# EAGLE design tangnano9k-bob-adapter (EAGLE 9.0.1)
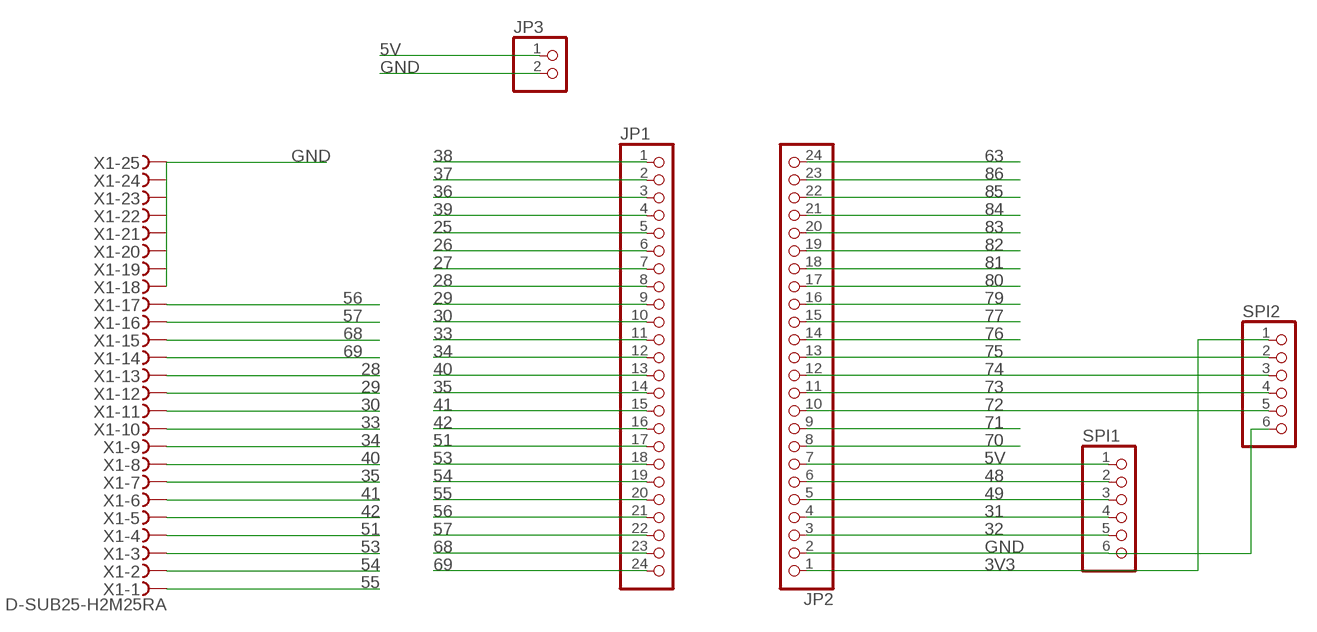
[diagram p0: schematic, sheet 1]

## Parts
JP1  PINHD-1X24  [1X24]
JP2  PINHD-1X24  [1X24]
JP3  PINHD-1X2  [1X02]
SPI1  PINHD-1X6  [1X06]
SPI2  PINHD-1X6  [1X06]
X1  D-SUB25-H2M25RA  [H2M25RA]

## Nets
3V3: JP2.1 SPI2.1
5V: JP2.7 JP3.1 SPI1.1
25: JP1.5
26: JP1.6
27: JP1.7
28: JP1.8 X1.13
29: JP1.9 X1.12
30: JP1.10 X1.11
31: JP2.4 SPI1.4
32: JP2.3 SPI1.5
33: JP1.11 X1.10
34: JP1.12 X1.9
35: JP1.14 X1.7
36: JP1.3
37: JP1.2
38: JP1.1
39: JP1.4
40: JP1.13 X1.8
41: JP1.15 X1.6
42: JP1.16 X1.5
48: JP2.6 SPI1.2
49: JP2.5 SPI1.3
51: JP1.17 X1.4
53: JP1.18 X1.3
54: JP1.19 X1.2
55: JP1.20 X1.1
56: JP1.21 X1.17
57: JP1.22 X1.16
63: JP2.24
68: JP1.23 X1.15
69: JP1.24 X1.14
70: JP2.8
71: JP2.9
72: JP2.10 SPI2.5
73: JP2.11 SPI2.4
74: JP2.12 SPI2.3
75: JP2.13 SPI2.2
76: JP2.14
77: JP2.15
79: JP2.16
80: JP2.17
81: JP2.18
82: JP2.19
83: JP2.20
84: JP2.21
85: JP2.22
86: JP2.23
GND: JP2.2 JP3.2 SPI1.6 SPI2.6 X1.18 X1.19 X1.20 X1.21 X1.22 X1.23 X1.24 X1.25

## Library data of the parts
JP1 JP2 = pinhead:PINHD-1X24: PIN HEADER
JP3 = pinhead:PINHD-1X2: PIN HEADER
SPI1 SPI2 = pinhead:PINHD-1X6: PIN HEADER
X1 = con-thomas-betts:D-SUB25-: D-Subminiatur Connector Source: Electronioc Interconnects European Edition 1998; OC_FARNELL: unknown; OC_NEWARK: unknown

## Board
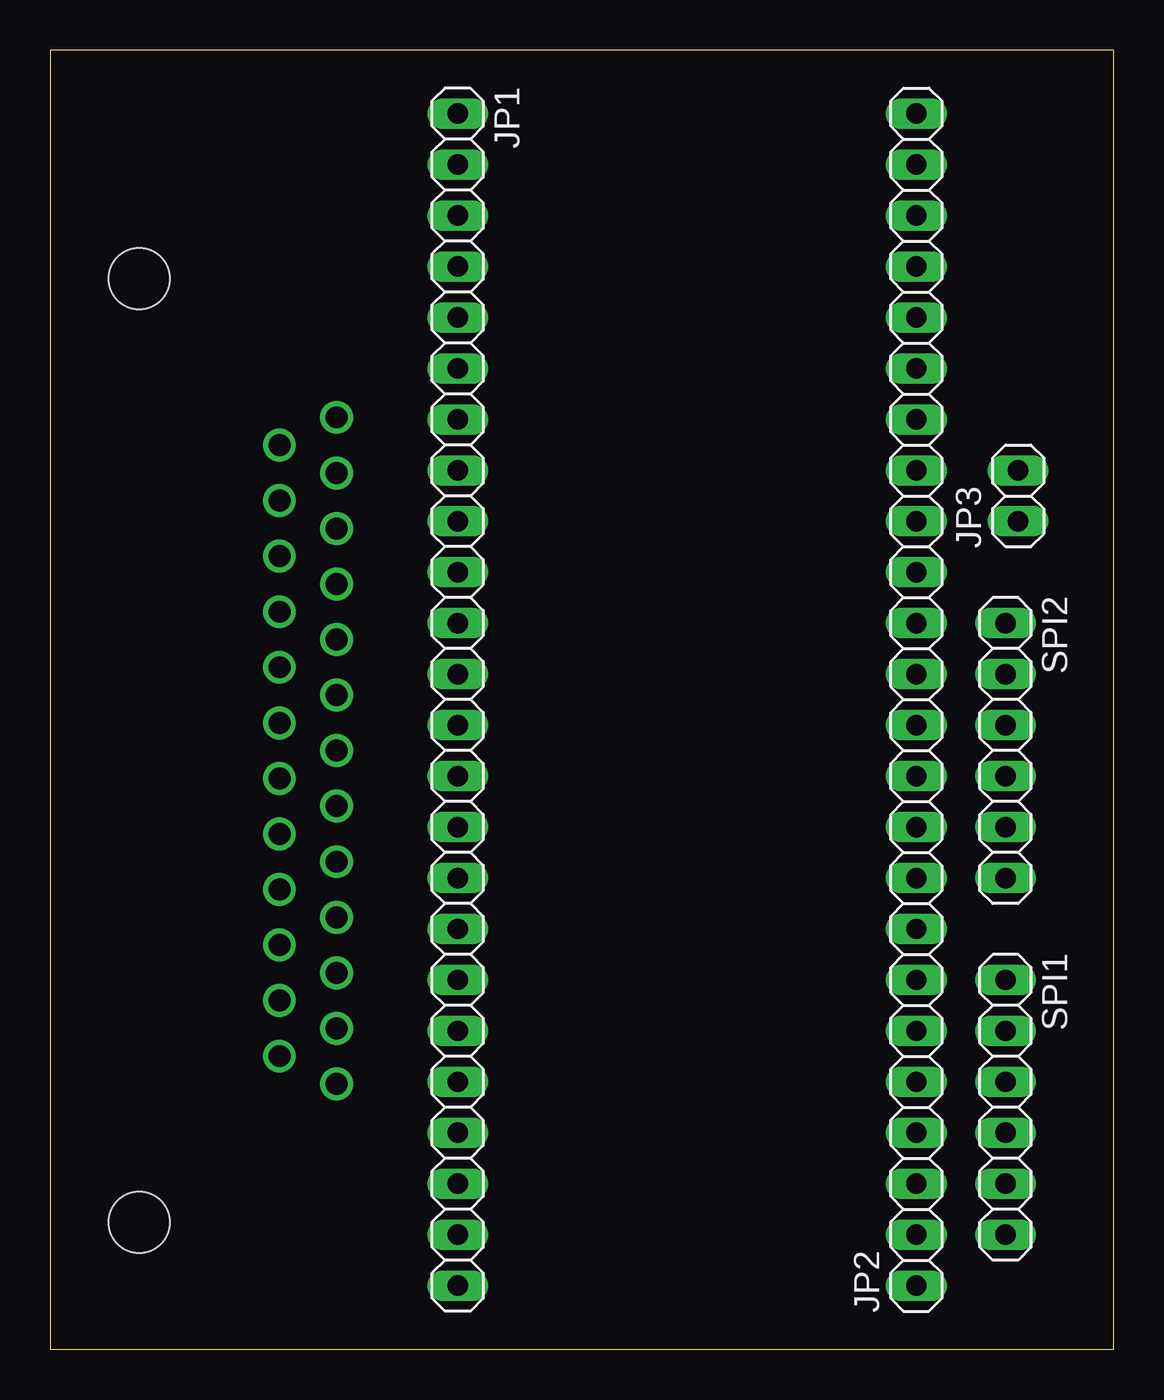
[diagram p1: board, top side]
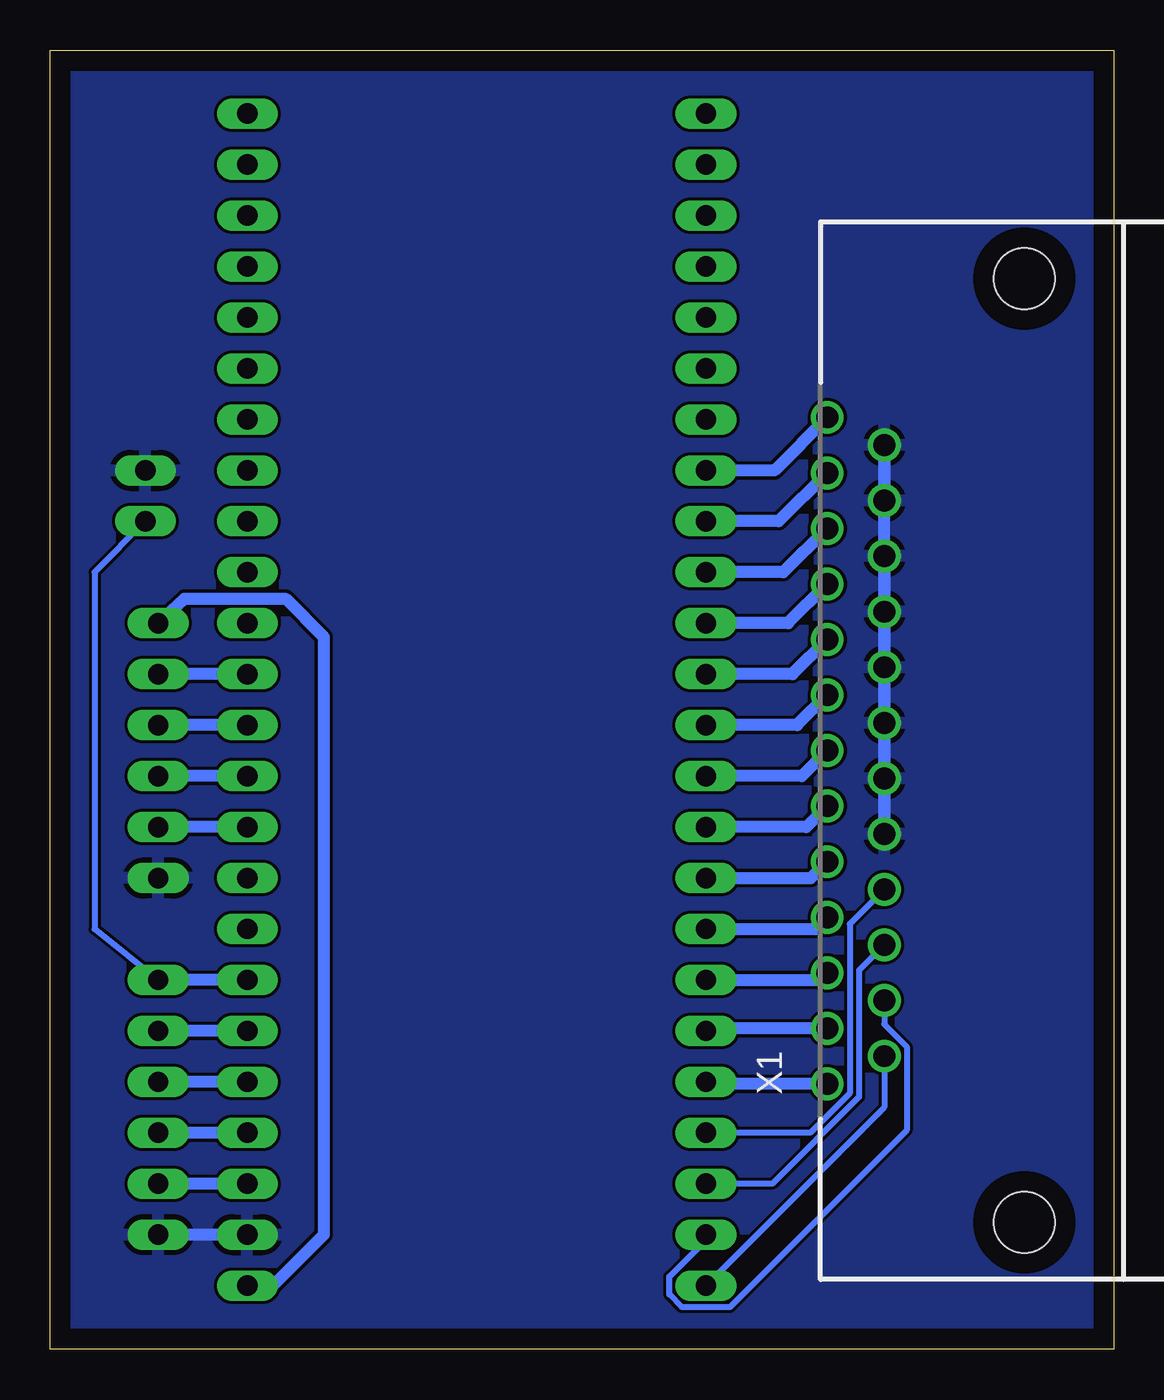
[diagram p2: board, bottom side, seen from below]

Size 53.01 x 64.76 mm. Coordinates in mm from the lower left corner, seen from the top.
Outline: 0,0 53.01,0 53.01,64.76 0,64.76 0,0
Copper layers (1*16): Top 0.035mm / dielectric 1.5mm / Bottom 0.035mm
Design rules "default": minimum track width 6mil, minimum drill 0.35mm, track to track 6mil, track to pad 6mil, pad to pad 6mil, via to via 6mil, smd to smd 6mil, copper to edge 40mil, drill to drill 6mil, minimum pad ring 10mil, minimum via ring 8mil, stop-mask expansion 4mil, vias tented up to drill 0mil, thermal gap 10mil

### Footprints (pad centres in the part's own frame; a part is rotated, then mirrored left to right if it is on the bottom)
1X24 = drill 1.016 long: 1 -29.21,0; 2 -26.67,0; 3 -24.13,0; 4 -21.59,0; 5 -19.05,0; 6 -16.51,0; 7 -13.97,0; 8 -11.43,0; 9 -8.89,0; 10 -6.35,0; 11 -3.81,0; 12 -1.27,0; 13 1.27,0; 14 3.81,0; 15 6.35,0; 16 8.89,0; 17 11.43,0; 18 13.97,0; 19 16.51,0; 20 19.05,0; 21 21.59,0; 22 24.13,0; 23 26.67,0; 24 29.21,0
1X02 = drill 1.016 long: 1 -1.27,0; 2 1.27,0
1X06 = drill 1.016 long: 1 -6.35,0; 2 -3.81,0; 3 -1.27,0; 4 1.27,0; 5 3.81,0; 6 6.35,0
H2M25RA = drill 1.092: 1 -16.612,7.925; 2 -13.843,7.925; 3 -11.074,7.925; 4 -8.306,7.925; 5 -5.537,7.925; 6 -2.769,7.925; 7 0,7.925; 8 2.769,7.925; 9 5.537,7.925; 10 8.306,7.925; 11 11.074,7.925; 12 13.843,7.925; 13 16.612,7.925; 14 -15.227,5.08; 15 -12.459,5.08; 16 -9.69,5.08; 17 -6.921,5.08; 18 -4.153,5.08; 19 -1.384,5.08; 20 1.384,5.08; 21 4.153,5.08; 22 6.921,5.08; 23 9.69,5.08; 24 12.459,5.08; 25 15.227,5.08 | hole 3.048: -23.52,-1.905; 23.52,-1.905

### Placement (x,y rotation side)
JP1  20.32,32.38 270 top
JP2  43.18,32.38 90 top
JP3  48.26,42.54 90 top
SPI1  47.62,12.06 270 top
SPI2  47.62,29.85 270 top
X1  6.35,29.85 90 bottom

### Tracks (layer width: path | path; a pad name or v marks a point on that pad's centre or on a via)
3V3
  Bottom 0.61: SPI2.1 46.3,37.41 41.28,37.41 39.37,35.51 39.37,5.71 41.91,3.17 JP2.1
5V
  Bottom 0.305: JP3.1 50.8,38.73 50.8,20.96 SPI1.1
  Bottom 0.61: JP2.7 SPI1.1
28
  Bottom 0.61: X1.13 16.92,43.81 JP1.8
29
  Bottom 0.61: X1.12 16.69,41.27 JP1.9
30
  Bottom 0.61: X1.11 16.46,38.73 JP1.10
31
  Bottom 0.61: JP2.4 SPI1.4
32
  Bottom 0.61: JP2.3 SPI1.5
33
  Bottom 0.61: X1.10 16.23,36.2 JP1.11
34
  Bottom 0.61: X1.9 16,33.66 JP1.12
35
  Bottom 0.61: X1.7 15.54,28.58 JP1.14
40
  Bottom 0.61: X1.8 15.77,31.12 JP1.13
41
  Bottom 0.61: X1.6 15.32,26.04 JP1.15
42
  Bottom 0.61: JP1.16 15.09,23.5 X1.5
48
  Bottom 0.61: JP2.6 SPI1.2
49
  Bottom 0.61: JP2.5 SPI1.3
51
  Bottom 0.61: JP1.17 14.86,20.96 X1.4
53
  Bottom 0.61: JP1.18 14.63,18.42 X1.3
54
  Bottom 0.61: X1.2 18.92,16 JP1.19
55
  Bottom 0.61: X1.1 18.95,13.23 JP1.20
56
  Bottom 0.305: X1.17 13.15,21.2 13.15,12.77 15.12,10.79 JP1.21
57
  Bottom 0.305: X1.16 12.69,18.89 12.69,12.58 17.02,8.26 JP1.22
68
  Bottom 0.305: X1.15 11.43,16.21 10.31,15.08 10.31,10.92 19.12,2.11 21.52,2.11 22.15,2.73 22.15,3.62 20.32,5.45 JP1.23
69
  Bottom 0.305: X1.14 11.43,12.06 JP1.24
72
  Bottom 0.61: JP2.10 SPI2.5
73
  Bottom 0.61: JP2.11 SPI2.4
74
  Bottom 0.61: JP2.12 SPI2.3
75
  Bottom 0.61: JP2.13 SPI2.2
GND
  Bottom 0.61: JP2.2 SPI1.6 | X1.25 X1.24 X1.23 X1.22 X1.21 X1.20 X1.19 X1.18 X1.25
  pour Bottom: -7.62,66.68 -7.62,-1.91 55.24,-1.91 55.24,66.68